# EAGLE design SBC_65C02_ISA_IRQ_v2 (EAGLE 9.6.2)
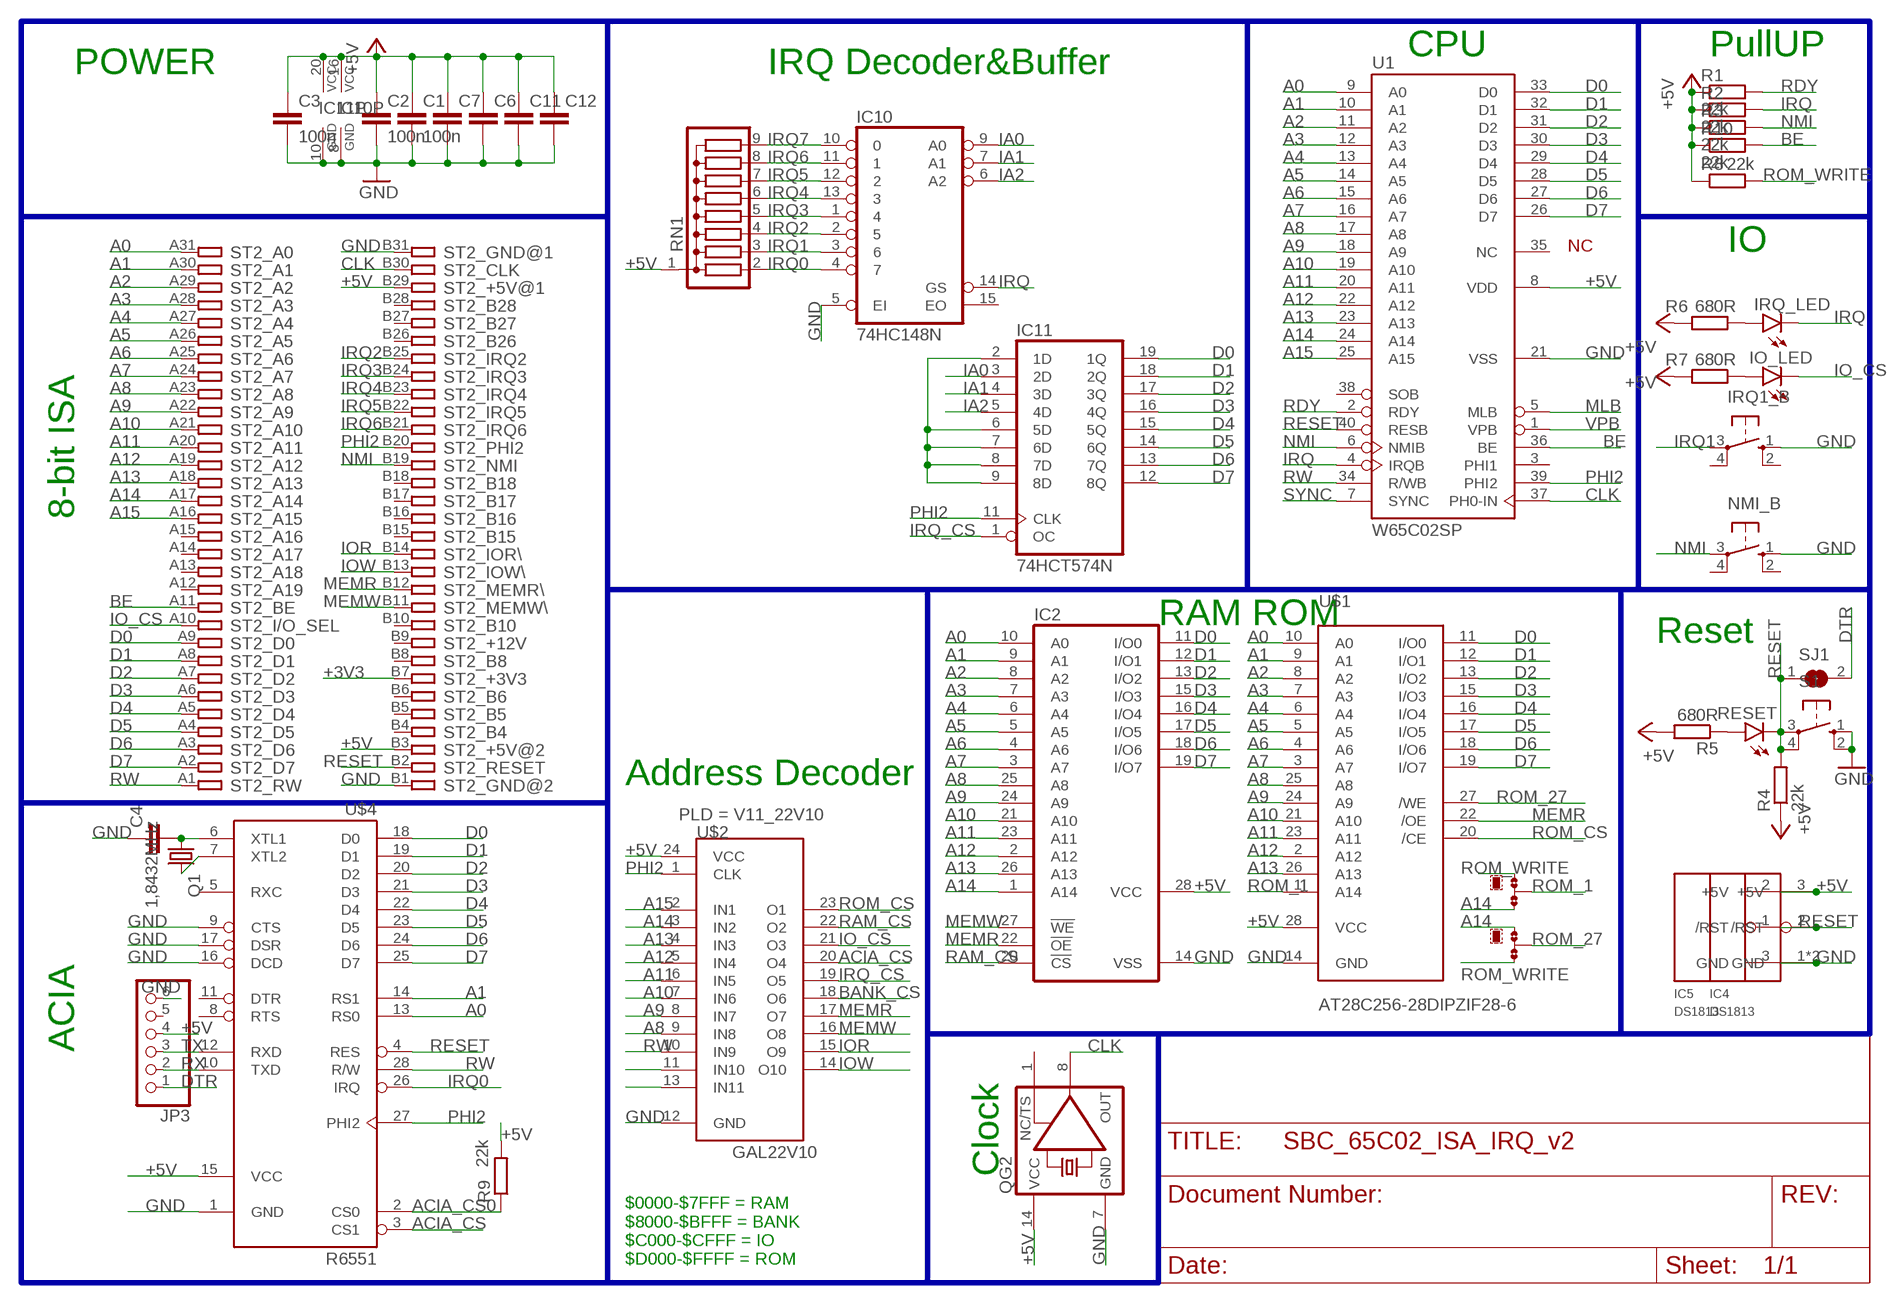
[diagram p0: schematic, sheet 1]

## Parts
C1  100n  C-EU050-025X075  [C050-025X075]
C2  100n  C-EU050-025X075  [C050-025X075]
C3  100n  C-EU050-025X075  [C050-025X075]
C4  C-EU025-030X050  [C025-030X050]
C6  C-EU050-035X075  [C050-035X075]
C7  C-EU050-035X075  [C050-035X075]
C11  C-EU050-035X075  [C050-035X075]
C12  C-EU050-035X075  [C050-035X075]
IC2  62256P  [DIL28-6]
IC4  DS1813  DS1813SOT-223  [SOT223]
IC5  DS1813  [TO-92]
IC10  74HC148N  [DIL16]
IC11  74HCT574N  [DIL20]
IO_LED  LED5MM  [LED5MM]
IRQ1_B  10-XX  [B3F-10XX]
IRQ_LED  LED5MM  [LED5MM]
JP3  PINHD-1X6/90  [1X06/90]
NMI_B  10-XX  [B3F-10XX]
Q1  1,8432MHz  CRYSTALHC49S  [HC49/S]
QG2  XO-14  [DIL14S]
R1  22k  R-EU_0207/10  [0207/10]
R2  22k  R-EU_0207/10  [0207/10]
R3  22k  R-EU_0207/10  [0207/10]
R4  22k  R-EU_0207/10  [0207/10]
R5  680R  R-EU_0207/10  [0207/10]
R6  680R  R-EU_0207/10  [0207/10]
R7  680R  R-EU_0207/10  [0207/10]
R8  22k  R-EU_0207/10  [0207/10]
R9  22k  R-EU_0207/10  [0207/10]
R10  22k  R-EU_0207/10  [0207/10]
RESET  LED5MM  [LED5MM]
RN1  G08R  [SIL9]
ROM_1  0R-JUMPA  [A0R-JMP]
ROM_27  0R-JUMPA  [A0R-JMP]
S1  10-XX  [B3F-10XX]
SJ1  SJ  [SJ]
ST2  IBM8BIT_ISA  [IBM8BIT]
U1  W65C02SP  [DIP-40]
U$1  AT28C256-28DIPZIF28-6  [228-1277-00-0602J]
U$2  GAL22V10  [DIL28_1]
U$4  R6551  [DIP-28]

## Nets
+3V3: ST2.B7
+5V [power]: C1.1 C2.1 C3.1 C6.1 C7.1 C11.1 C12.1 IC2.28(VCC) IC4.3(+5V) IC5.2(+5V) IC10.16(VCC) IC11.20(VCC) JP3.4 QG2.14(VCC) R1.1 R2.1 R3.1 R4.1 R5.2 R6.2 R7.2 R8.1 R9.2 R10.1 RN1.1 ST2.B3 ST2.B29 U1.8(VDD) U$1.28(VCC) U$2.24(VCC) U$4.15(VCC)
A0: IC2.10(A0) ST2.A31 U1.9(A0) U$1.10(A0) U$4.13(RS0)
A1: IC2.9(A1) ST2.A30 U1.10(A1) U$1.9(A1) U$4.14(RS1)
A2: IC2.8(A2) ST2.A29 U1.11(A2) U$1.8(A2)
A3: IC2.7(A3) ST2.A28 U1.12(A3) U$1.7(A3)
A4: IC2.6(A4) ST2.A27 U1.13(A4) U$1.6(A4)
A5: IC2.5(A5) ST2.A26 U1.14(A5) U$1.5(A5)
A6: IC2.4(A6) ST2.A25 U1.15(A6) U$1.4(A6)
A7: IC2.3(A7) ST2.A24 U1.16(A7) U$1.3(A7)
A8: IC2.25(A8) ST2.A23 U1.17(A8) U$1.25(A8) U$2.9(IN8)
A9: IC2.24(A9) ST2.A22 U1.18(A9) U$1.24(A9) U$2.8(IN7)
A10: IC2.21(A10) ST2.A21 U1.19(A10) U$1.21(A10) U$2.7(IN6)
A11: IC2.23(A11) ST2.A20 U1.20(A11) U$1.23(A11) U$2.6(IN5)
A12: IC2.2(A12) ST2.A19 U1.22(A12) U$1.2(A12) U$2.5(IN4)
A13: IC2.26(A13) ST2.A18 U1.23(A13) U$1.26(A13) U$2.4(IN3)
A14: IC2.1(A14) ROM_1.3 ROM_27.1 ST2.A17 U1.24(A14) U$2.3(IN2)
A15: ST2.A16 U1.25(A15) U$2.2(IN1)
ACIA_CS: U$2.20(O4) U$4.3(CS1)
ACIA_CS0: R9.1 U$4.2(CS0)
BANK_CS: U$2.18(O6)
BE: R10.2 ST2.A11 U1.36(BE)
CLK: QG2.8(OUT) ST2.B30 U1.37(PH0-IN)
D0: IC2.11(I/O0) IC11.19(1Q) ST2.A9 U1.33(D0) U$1.11(I/O0) U$4.18(D0)
D1: IC2.12(I/O1) IC11.18(2Q) ST2.A8 U1.32(D1) U$1.12(I/O1) U$4.19(D1)
D2: IC2.13(I/O2) IC11.17(3Q) ST2.A7 U1.31(D2) U$1.13(I/O2) U$4.20(D2)
D3: IC2.15(I/O3) IC11.16(4Q) ST2.A6 U1.30(D3) U$1.15(I/O3) U$4.21(D3)
D4: IC2.16(I/O4) IC11.15(5Q) ST2.A5 U1.29(D4) U$1.16(I/O4) U$4.22(D4)
D5: IC2.17(I/O5) IC11.14(6Q) ST2.A4 U1.28(D5) U$1.17(I/O5) U$4.23(D5)
D6: IC2.18(I/O6) IC11.13(7Q) ST2.A3 U1.27(D6) U$1.18(I/O6) U$4.24(D6)
D7: IC2.19(I/O7) IC11.12(8Q) ST2.A2 U1.26(D7) U$1.19(I/O7) U$4.25(D7)
DTR: JP3.1 SJ1.2
GND [power]: C1.2 C2.2 C3.2 C4.1 C6.2 C7.2 C11.2 C12.2 IC2.14(VSS) IC4.1(GND) IC4.4(GND) IC5.3(GND) IC10.5(EI) IC10.8(GND) IC11.10(GND) IRQ1_B.1(S) JP3.6 NMI_B.1(S) QG2.7(GND) S1.1(S) S1.2(S1) ST2.B1 ST2.B31 U1.21(VSS) U$1.14(GND) U$2.12(GND) U$4.1(GND) U$4.9(CTS) U$4.16(DCD) U$4.17(DSR)
IA0: IC10.9(A0) IC11.3(2D)
IA1: IC10.7(A1) IC11.4(3D)
IA2: IC10.6(A2) IC11.5(4D)
IO_CS: IO_LED.K(C) ST2.A10 U$2.21(O3)
IOR: ST2.B14 U$2.15(O9)
IOW: ST2.B13 U$2.14(O10)
IRQ: IC10.14(GS) IRQ_LED.K(C) R2.2 U1.4(IRQB)
IRQ0: IC10.4 RN1.2 U$4.26(IRQ)
IRQ1: IC10.3 IRQ1_B.3(P) RN1.3
IRQ2: IC10.2 RN1.4 ST2.B25
IRQ3: IC10.1 RN1.5 ST2.B24
IRQ4: IC10.13 RN1.6 ST2.B23
IRQ5: IC10.12 RN1.7 ST2.B22
IRQ6: IC10.11 RN1.8 ST2.B21
IRQ7: IC10.10 RN1.9
IRQ_CS: IC11.1(OC) U$2.19(O5)
MEMR: IC2.22(!OE) ST2.B12 U$1.22(/OE) U$2.17(O7)
MEMW: IC2.27(!WE) ST2.B11 U$2.16(O8)
MLB: U1.5(MLB)
N$2: IRQ_LED.A R6.1
N$6: R5.1 RESET.A
N$13: IO_LED.A R7.1
N$25: IC11.2(1D) IC11.6(5D) IC11.7(6D) IC11.8(7D) IC11.9(8D)
N$30: U$2.11(IN10)
N$31: U$2.13(IN11)
N$40: C4.2 Q1.1 U$4.6(XTL1)
N$41: Q1.2 U$4.7(XTL2)
NMI: NMI_B.3(P) R3.2 ST2.B19 U1.6(NMIB)
PHI2: IC11.11(CLK) ST2.B20 U1.39(PHI2) U$2.1(CLK) U$4.27(PHI2)
RAM_CS: IC2.20(!CS) U$2.22(O2)
RDY: R1.2 U1.2(RDY)
RESET: IC4.2(/RST) IC5.1(/RST) R4.2 RESET.K(C) S1.3(P) S1.4(P1) SJ1.1 ST2.B2 U1.40(RESB) U$4.4(RES)
ROM_1: ROM_1.2 U$1.1(A14)
ROM_27: ROM_27.2 U$1.27(/WE)
ROM_CS: U$1.20(/CE) U$2.23(O1)
ROM_WRITE: R8.2 ROM_1.1 ROM_27.3
RW: ST2.A1 U1.34(R/WB) U$2.10(IN9) U$4.28(R/W)
RX: JP3.2 U$4.10(TXD)
SYNC: U1.7(SYNC)
TX: JP3.3 U$4.12(RXD)
VPB: U1.1(VPB)
Unconnected: IC10.15(EO) IRQ1_B.2(S1) IRQ1_B.4(P1) JP3.5 NMI_B.2(S1) NMI_B.4(P1) QG2.1(TS) ST2.A12 ST2.A13 ST2.A14 ST2.A15 ST2.B4 ST2.B5 ST2.B6 ST2.B8 ST2.B9 ST2.B10 ST2.B15 ST2.B16 ST2.B17 ST2.B18 ST2.B26 ST2.B27 ST2.B28 U1.3(PHI1) U1.35(NC) U1.38(SOB) U$4.5(RXC) U$4.8(RTS) U$4.11(DTR)

## Buses
A8,A9,A10,A11,ACIA_CS,IO_CS,IO_CS_N,N$3,N$4,N$8,N$10

## Notes on the sheet
- CPU | PullUP
- POWER | IRQ Decoder&Buffer
- IO
- 8-bit ISA
- RAM ROM
- Reset
- Address Decoder
- PLD = V11_22V10
- ACIA
- Clock
- $0000-$7FFF = RAM
  $8000-$BFFF = BANK
  $C000-$CFFF = IO
  $D000-$FFFF = ROM

## Library data of the parts
C1-C3 = rcl:C-EU: CAPACITOR, European symbol
C4 C6 C7 C11 C12 = rcl:C-EU: CAPACITOR, European symbol; SPICEPREFIX: C
IC2 = memory-hitachi:62256P: MEMORY; OC_FARNELL: unknown; OC_NEWARK: unknown
IC4 IC5 = ds1813_revised:DS1813
IC10 = 74xx-eu:74*148: 10-line to 4-line and 8-line to 3-line PRIORITY ENCODER
IC11 = 74xx-eu:74*574: 8-bit D type FLIP FLOP bus driver
IO_LED IRQ_LED RESET = led:LED: LED OSRAM: - CHIPLED LG R971, LG N971, LY N971, LG Q971, LY Q971, LO R971, LY R971 LH N974, LH R974 LS Q976, LO Q976, LY Q976 LO Q996 - Hyper CHIPLED LW Q18S LB Q993, LB Q99A, LB R99A - SideLED LS A670, LO A670, LY A670, LG A670, LP A670 LB A673, LV A673, LT A673, LW A673 LH A674 LY A675 LS A676, LA A676, LO A676, LY A676, LW A676 LS A679, LY A679, LG A679 - Hyper Micro SIDELED® LS Y876, LA Y876, LO Y876, LY Y876 LT Y87S - SmartLED LW L88C, LW L88S LB L89C, LB L89S, LG L890 LS L89K, LO L89K, LY L89K LS L896, LA L896, LO L896, LY L896 - TOPLED LS T670, LO T670, LY T670, LG T670, LP T670 LSG T670, LSP T670, LSY T670, LOP T670, LYG T670 LG T671, LOG T671, LSG T671 LB T673, LV T673, LT T673, LW T673 LH T674 LS T676, LA T676, LO T676, LY T676, LB T676, LH T676, LSB T676, LW T676 LB T67C, LV T67C, LT T67C, LS T67K, LO T67K, LY T67K, LW E67C LS E67B, LA E67B, LO E67B, LY E67B, LB E67C, LV E67C, LT E67C LW T67C LS T679, LY T679, LG T679 LS T770, LO T770, LY T770, LG T770, LP T770 LB T773, LV T773, LT T773, LW T773 LH T774 LS E675, LA E675, LY E675, LS T675 LS T776, LA T776, LO T776, LY T776, LB T776 LHGB T686 LT T68C, LB T68C - Hyper Mini TOPLED® LB M676 - Mini TOPLED Santana® LG M470 LS M47K, LO M47K, LY M47K Source: http://www.osram.convergy.de LUXEON: - LUMILED® LXK2-PW12-R00, LXK2-PW12-S00, LXK2-PW14-U00, LXK2-PW14-V00 LXK2-PM12-R00, LXK2-PM12-S00, LXK2-PM14-U00 LXK2-PE12-Q00, LXK2-PE12-R00, LXK2-PE12-S00, LXK2-PE14-T00, LXK2-PE14-U00 LXK2-PB12-K00, LXK2-PB12-L00, LXK2-PB12-M00, LXK2-PB14-N00, LXK2-PB14-P00, LXK2-PB14-Q00 LXK2-PR12-L00, LXK2-PR12-M00, LXK2-PR14-Q00, LXK2-PR14-R00 LXK2-PD12-Q00, LXK2-PD12-R00, LXK2-PD12-S00 LXK2-PH12-R00, LXK2-PH12-S00 LXK2-PL12-P00, LXK2-PL12-Q00, LXK2-PL12-R00 Source: www.luxeon.com KINGBRIGHT: KA-3528ASYC Source: www.kingbright.com
IRQ1_B NMI_B S1 = switch-omron:10-XX: OMRON SWITCH; MPN: B3F-1000; OC_FARNELL: 176432; OC_NEWARK: 36M3542
JP3 = pinhead:PINHD-1X6: PIN HEADER
Q1 = crystal:CRYSTAL: CRYSTAL; OC_FARNELL: 1667008; OC_NEWARK: unknown
QG2 = crystal:XO-: CRYSTAL; OC_FARNELL: unknown; OC_NEWARK: unknown
R1-R3 R10 = rcl:R-EU_: RESISTOR, European symbol
R4-R7 = resistor:R-EU_: RESISTOR, European symbol
R8 R9 = rcl:R-EU_: RESISTOR, European symbol; SPICEPREFIX: R
RN1 = resistor-sil:G08R: SIL RESISTOR; OC_FARNELL: unknown; OC_NEWARK: unknown
ROM_1 ROM_27 = jump-0r-smd:0R-JUMP: SMD 0R 0805 Jumper
SJ1 = jumper:SJ: SMD solder JUMPER
ST2 = TiRoRiN_Libs:IBM8BIT_ISA: 8-bit CARD IBM/PC-AT
U1 = 65xxx:W65C02SP: Western Digital Version
U$1 = atmel-custom:AT28C256-28DIP: IC EEPROM 256KBIT 150NS 28DIP
U$2 = TiRoRiN_Libs:GAL22V10
U$4 = 65xxx:R6551: Rockwell R6551 ACIA Asynchronous Communiations Interface Adapter, providing UART and on-chip baud rate generator using a standard 1.8432 MHz external crystal, for speeds from 50 to 19,200 baud.

## Net classes
0 default: width 0.152 mm, drill 0.66 mm, clearance 0.254 mm
1 power: width 0.508 mm, drill 0.66 mm, clearance 0.381 mm to class 0, clearance 0.381 mm
2 data: width 0.381 mm, drill 0.66 mm, clearance 0.254 mm to class 0, clearance 0.254 mm to class 1, clearance 0.254 mm

## Board
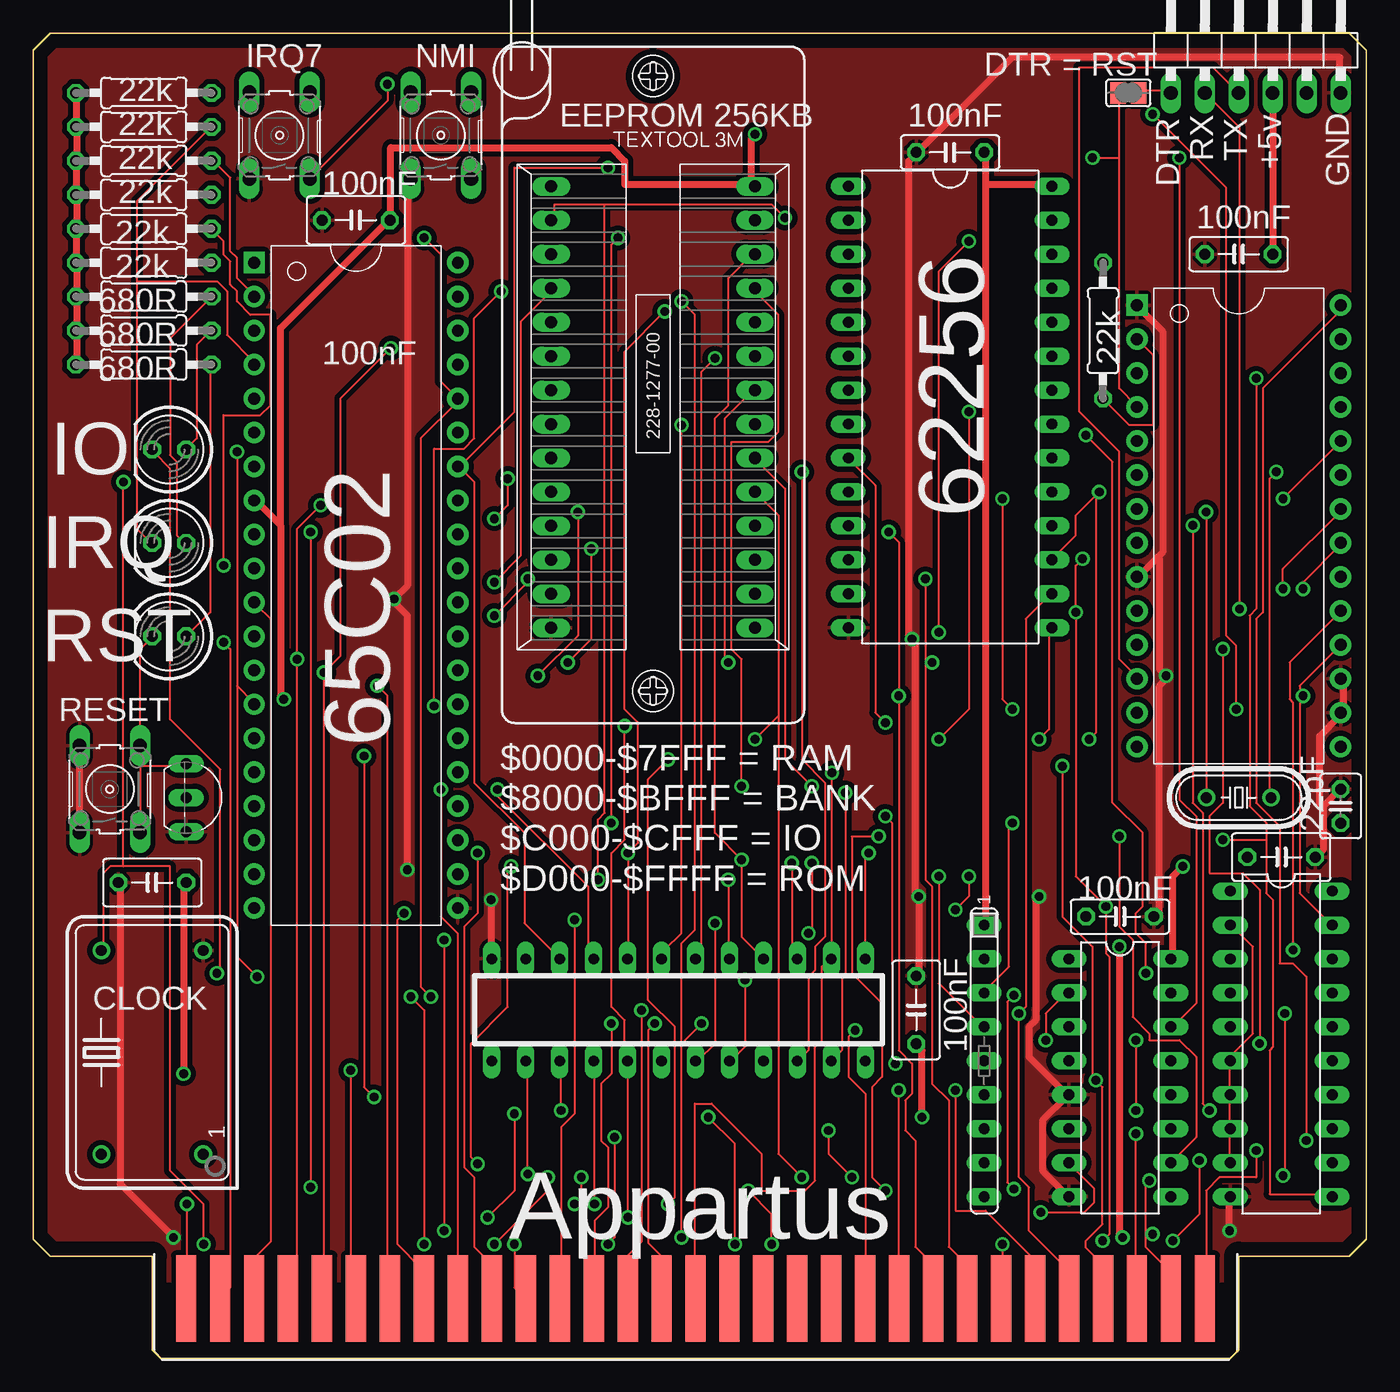
[diagram p1: board, top side]
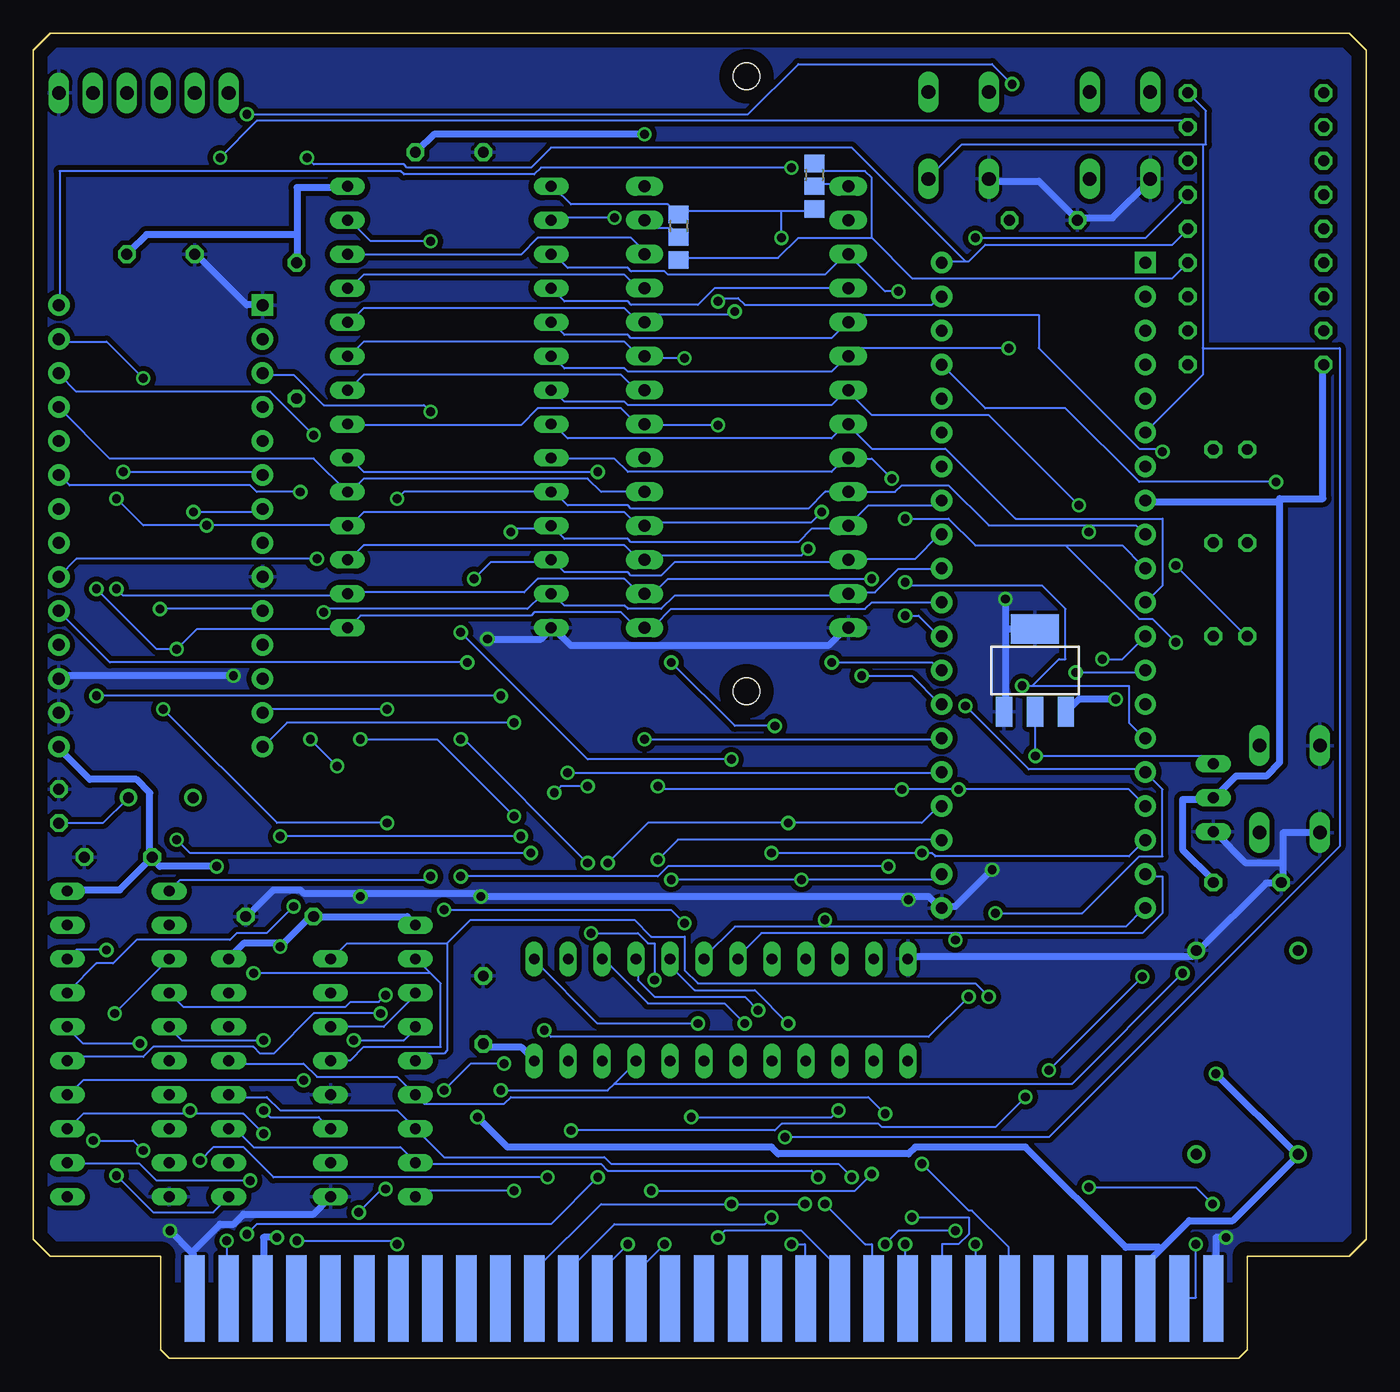
[diagram p2: board, bottom side, seen from below]

Size 99.7 x 99.06 mm. Coordinates in mm from the lower left corner, seen from the top.
Copper layers (1*16): Top 0.035mm / dielectric 1.5mm / Bottom 0.035mm
Design rules "appartus": minimum track width 6mil, minimum drill 0.35mm, track to track 6mil, track to pad 6mil, pad to pad 6mil, via to via 6mil, smd to smd 6mil, copper to edge 40mil, drill to drill 6mil, minimum pad ring 10mil, minimum via ring 8mil, stop-mask expansion 4mil, vias tented up to drill 0mil, thermal gap 10mil

### Footprints (pad centres in the part's own frame; a part is rotated, then mirrored left to right if it is on the bottom)
C050-025X075 = drill 0.813 octagon: 1 -2.54,0; 2 2.54,0
C025-030X050 = drill 0.813 octagon: 1 -1.27,0; 2 1.27,0
C050-035X075 = drill 0.813 octagon: 1 -2.54,0; 2 2.54,0
DIL28-6 = drill 0.813 long: 1 -16.51,-7.62; 2 -13.97,-7.62; 3 -11.43,-7.62; 4 -8.89,-7.62; 5 -6.35,-7.62; 6 -3.81,-7.62; 7 -1.27,-7.62; 8 1.27,-7.62; 9 3.81,-7.62; 10 6.35,-7.62; 11 8.89,-7.62; 12 11.43,-7.62; 13 13.97,-7.62; 14 16.51,-7.62; 15 16.51,7.62; 16 13.97,7.62; 17 11.43,7.62; 18 8.89,7.62; 19 6.35,7.62; 20 3.81,7.62; 21 1.27,7.62; 22 -1.27,7.62; 23 -3.81,7.62; 24 -6.35,7.62; 25 -8.89,7.62; 26 -11.43,7.62; 27 -13.97,7.62; 28 -16.51,7.62
SOT223 = smd 1.219 x 2.235: 1 -2.311,-3.099; 2 0,-3.099; 3 2.311,-3.099 | smd 3.6 x 2.2: 4 0,3.099
TO-92 = drill 0.813 long: 1 -2.54,0; 2 0,0; 3 2.54,0
DIL16 = drill 0.813 long: 1 -8.89,-3.81; 2 -6.35,-3.81; 3 -3.81,-3.81; 4 -1.27,-3.81; 5 1.27,-3.81; 6 3.81,-3.81; 7 6.35,-3.81; 8 8.89,-3.81; 9 8.89,3.81; 10 6.35,3.81; 11 3.81,3.81; 12 1.27,3.81; 13 -1.27,3.81; 14 -3.81,3.81; 15 -6.35,3.81; 16 -8.89,3.81
DIL20 = drill 0.813 long: 1 -11.43,-3.81; 2 -8.89,-3.81; 3 -6.35,-3.81; 4 -3.81,-3.81; 5 -1.27,-3.81; 6 1.27,-3.81; 7 3.81,-3.81; 8 6.35,-3.81; 9 8.89,-3.81; 10 11.43,-3.81; 11 11.43,3.81; 12 8.89,3.81; 13 6.35,3.81; 14 3.81,3.81; 15 1.27,3.81; 16 -1.27,3.81; 17 -3.81,3.81; 18 -6.35,3.81; 19 -8.89,3.81; 20 -11.43,3.81
LED5MM = drill 0.813 octagon: A -1.27,0; K 1.27,0
B3F-10XX = drill 1.016 long: 1 -3.251,2.261; 2 3.251,2.261; 3 -3.251,-2.261; 4 3.251,-2.261
1X06/90 = drill 1.016 long: 1 -6.35,-3.81; 2 -3.81,-3.81; 3 -1.27,-3.81; 4 1.27,-3.81; 5 3.81,-3.81; 6 6.35,-3.81
HC49/S = drill 0.813: 1 -2.413,0; 2 2.413,0
DIL14S = drill 0.813: 1 -7.62,-3.81; 7 7.62,-3.81; 8 7.62,3.81; 14 -7.62,3.81
0207/10 = drill 0.813 octagon: 1 -5.08,0; 2 5.08,0
SIL9 = drill 0.813 long: 1 -10.16,0; 2 -7.62,0; 3 -5.08,0; 4 -2.54,0; 5 0,0; 6 2.54,0; 7 5.08,0; 8 7.62,0; 9 10.16,0
A0R-JMP = smd 1.5 x 1.3: 1 0,1.7; 2 0,0; 3 0,-1.7
SJ = smd 1.168 x 1.6: 1 -0.762,0; 2 0.762,0
IBM8BIT = smd 1.524 x 6.477: A1 38.1,-44.45; A2 35.56,-44.45; A3 33.02,-44.45; A4 30.48,-44.45; A5 27.94,-44.45; A6 25.4,-44.45; A7 22.86,-44.45; A8 20.32,-44.45; A9 17.78,-44.45; A10 15.24,-44.45; A11 12.7,-44.45; A12 10.16,-44.45; A13 7.62,-44.45; A14 5.08,-44.45; A15 2.54,-44.45; A16 0,-44.45; A17 -2.54,-44.45; A18 -5.08,-44.45; A19 -7.62,-44.45; A20 -10.16,-44.45; A21 -12.7,-44.45; A22 -15.24,-44.45; A23 -17.78,-44.45; A24 -20.32,-44.45; A25 -22.86,-44.45; A26 -25.4,-44.45; A27 -27.94,-44.45; A28 -30.48,-44.45; A29 -33.02,-44.45; A30 -35.56,-44.45; A31 -38.1,-44.45 | smd 1.524 x 6.477 bottom: B1 38.1,-44.45; B2 35.56,-44.45; B3 33.02,-44.45; B4 30.48,-44.45; B5 27.94,-44.45; B6 25.4,-44.45; B7 22.86,-44.45; B8 20.32,-44.45; B9 17.78,-44.45; B10 15.24,-44.45; B11 12.7,-44.45; B12 10.16,-44.45; B13 7.62,-44.45; B14 5.08,-44.45; B15 2.54,-44.45; B16 0,-44.45; B17 -2.54,-44.45; B18 -5.08,-44.45; B19 -7.62,-44.45; B20 -10.16,-44.45; B21 -12.7,-44.45; B22 -15.24,-44.45; B23 -17.78,-44.45; B24 -20.32,-44.45; B25 -22.86,-44.45; B26 -25.4,-44.45; B27 -27.94,-44.45; B28 -30.48,-44.45; B29 -33.02,-44.45; B30 -35.56,-44.45; B31 -38.1,-44.45
DIP-40 = drill 0.889 pad 1.6 square: 1 -22.86,-7.62 | drill 0.889 pad 1.6: 2 -20.32,-7.62; 3 -17.78,-7.62; 4 -15.24,-7.62; 5 -12.7,-7.62; 6 -10.16,-7.62; 7 -7.62,-7.62; 8 -5.08,-7.62; 9 -2.54,-7.62; 10 0,-7.62; 11 2.54,-7.62; 12 5.08,-7.62; 13 7.62,-7.62; 14 10.16,-7.62; 15 12.7,-7.62; 16 15.24,-7.62; 17 17.78,-7.62; 18 20.32,-7.62; 19 22.86,-7.62; 20 25.4,-7.62; 21 25.4,7.62; 22 22.86,7.62; 23 20.32,7.62; 24 17.78,7.62; 25 15.24,7.62; 26 12.7,7.62; 27 10.16,7.62; 28 7.62,7.62; 29 5.08,7.62; 30 2.54,7.62; 31 0,7.62; 32 -2.54,7.62; 33 -5.08,7.62; 34 -7.62,7.62; 35 -10.16,7.62; 36 -12.7,7.62; 37 -15.24,7.62; 38 -17.78,7.62; 39 -20.32,7.62; 40 -22.86,7.62
228-1277-00-0602J = drill 0.9 long: 1 -16.51,-7.62; 2 -13.97,-7.62; 3 -11.43,-7.62; 4 -8.89,-7.62; 5 -6.35,-7.62; 6 -3.81,-7.62; 7 -1.27,-7.62; 8 1.27,-7.62; 9 3.81,-7.62; 10 6.35,-7.62; 11 8.89,-7.62; 12 11.43,-7.62; 13 13.97,-7.62; 14 16.51,-7.62; 15 16.51,7.62; 16 13.97,7.62; 17 11.43,7.62; 18 8.89,7.62; 19 6.35,7.62; 20 3.81,7.62; 21 1.27,7.62; 22 -1.27,7.62; 23 -3.81,7.62; 24 -6.35,7.62; 25 -8.89,7.62; 26 -11.43,7.62; 27 -13.97,7.62; 28 -16.51,7.62 | hole 2: 21.24,0; -24.74,0
DIL28_1 = drill 0.8 long: 1 -3.81,10.16; 2 -3.81,7.62; 3 -3.81,5.08; 4 -3.81,2.54; 5 -3.81,0; 6 -3.81,-2.54; 7 -3.81,-5.08; 8 -3.81,-7.62; 9 -3.81,-10.16; 10 -3.81,-12.7; 11 -3.81,-15.24; 12 -3.81,-17.78; 13 3.81,-17.78; 14 3.81,-15.24; 15 3.81,-12.7; 16 3.81,-10.16; 17 3.81,-7.62; 18 3.81,-5.08; 19 3.81,-2.54; 20 3.81,0; 21 3.81,2.54; 22 3.81,5.08; 23 3.81,7.62; 24 3.81,10.16
DIP-28 = drill 0.889 pad 1.6 square: 1 -15.24,-7.62 | drill 0.889 pad 1.6: 2 -12.7,-7.62; 3 -10.16,-7.62; 4 -7.62,-7.62; 5 -5.08,-7.62; 6 -2.54,-7.62; 7 0,-7.62; 8 2.54,-7.62; 9 5.08,-7.62; 10 7.62,-7.62; 11 10.16,-7.62; 12 12.7,-7.62; 13 15.24,-7.62; 14 17.78,-7.62; 15 17.78,7.62; 16 15.24,7.62; 17 12.7,7.62; 18 10.16,7.62; 19 7.62,7.62; 20 5.08,7.62; 21 2.54,7.62; 22 0,7.62; 23 -2.54,7.62; 24 -5.08,7.62; 25 -7.62,7.62; 26 -10.16,7.62; 27 -12.7,7.62; 28 -15.24,7.62

### Placement (x,y rotation side)
C1  81.28,33.02 0 top
C2  68.58,90.17 180 top
C3  90.17,82.55 180 top
C4  97.79,41.28 270 top
C6  8.89,35.56 180 top
C7  24.13,85.09 180 top
C11  93.34,37.47 0 top
C12  66.04,26.04 90 top
IC2  68.58,71.12 270 top
IC4  24.77,51.44 0 bottom
IC5  11.43,41.91 270 top
IC10  81.28,20.96 270 top
IC11  93.34,23.5 270 top
IO_LED  10.16,67.94 180 top
IRQ1_B  18.42,91.44 90 top
IRQ_LED  10.16,60.96 180 top
JP3  91.44,98.43 0 top
NMI_B  30.48,91.44 90 top
Q1  90.17,41.91 180 top
QG2  8.89,22.86 90 top
R1  8.26,89.53 0 top
R2  8.26,92.08 0 top
R3  8.26,94.62 0 top
R4  8.26,84.46 0 top
R5  8.26,74.3 180 top
R6  8.26,79.38 180 top
R7  8.26,76.84 180 top
R8  8.26,81.91 0 top
R9  80.01,76.84 90 top
R10  8.26,87 0 top
RESET  10.16,53.98 180 top
RN1  71.12,22.23 270 top
ROM_1  41.28,87.63 0 bottom
ROM_27  51.44,83.82 0 bottom
S1  5.72,42.55 90 top
SJ1  81.92,94.62 0 top
ST2  49.53,48.9 0 top
U1  24.13,59.05 270 top
U$1  46.36,71.12 270 top
U$2  52.07,26.04 270 top
U$4  90.17,63.5 270 top

### Tracks (layer width: path | path; a pad name or v marks a point on that pad's centre or on a via)
+5V  (via drill 0.66)
  Top 0.508: v66.48,18.02 66.48,23.02 66.23,23.27 C12.1 | v81.48,9.02 81.23,9.27 v81.23,30.77 | v85.98,36.77 85.23,36.02 85.23,30.02 IC10.16 | C3.1 92.73,82.77 92.73,94.52 JP3.4 | 71.23,87.77 75.98,87.77 IC2.28 | 71.23,87.77 71.23,90.02 C2.1 | R3.1 3.23,94.52 3.23,92.27 R2.1 3.23,92.02 3.23,89.77 R1.1 3.23,89.52 3.23,87.02 R10.1 3.23,86.77 3.23,84.52 R4.1 3.23,84.27 3.23,82.02 R8.1 3.23,81.77 3.23,79.52 R6.2 3.23,79.27 3.23,77.02 R7.2 3.23,76.77 3.23,74.52 R5.2 | v18.73,49.27 18.48,49.52 18.48,62.27 | 18.48,62.27 16.73,64.02 U1.8 | 18.48,62.27 18.48,77.02 26.48,85.02 C7.1 26.73,85.27 26.73,90.52 43.23,90.52 44.23,89.52 44.23,87.77 53.73,87.77 U$1.28 53.73,88.02 53.73,91.27 v53.98,91.52 | 71.23,87.77 71.23,32.52 RN1.1 | v11.23,21.27 11.23,35.52 C6.1
  Bottom 0.508: U$2.24 62.23,22.27 63.23,23.27 65.98,23.27 C12.1 | 15.36,8.15 16.48,7.02 16.48,4.52 ST2.B29 | 15.36,8.15 13.23,10.27 9.98,10.27 5.23,15.02 QG2.14 5.23,15.27 v11.23,21.27 | v66.48,18.02 64.23,15.77 44.48,15.77 43.98,15.27 34.23,15.27 33.73,15.77 25.48,15.77 17.98,8.27 15.48,8.27 15.36,8.15 | C11.1 90.98,37.27 93.23,35.02 96.98,35.02 IC11.20 | U$4.15 97.73,45.52 95.48,43.27 91.98,43.27 90.98,42.27 90.98,37.52 C11.1 | RN1.1 71.23,32.52 71.73,33.02 C1.1 78.98,33.02 80.98,31.02 81.23,31.02 | 81.23,31.02 83.98,31.02 84.98,30.02 IC10.16 | v81.48,9.02 82.48,9.02 82.48,4.52 ST2.B3 | v81.23,30.77 81.23,31.02 | v85.98,36.77 90.23,36.77 90.73,37.27 C11.1 | 79.98,84.02 79.98,87.52 76.23,87.52 IC2.28 | 79.98,84.02 79.98,82.02 R9.2 | 79.98,84.02 91.23,84.02 92.48,82.77 C3.1 | C6.1 11.48,35.77 13.73,38.02 13.73,41.77 11.48,41.77 IC5.2 11.23,42.02 9.73,43.52 7.48,43.52 6.48,44.52 6.48,64.02 | v18.73,49.27 21.48,49.27 22.23,48.52 IC4.3 | 6.48,64.02 16.48,64.02 U1.8 | R5.2 3.23,74.27 3.23,64.27 6.48,64.27 6.48,64.02 | v53.98,91.52 69.73,91.52 70.98,90.27 C2.1
A0  (via drill 0.66)
  Top 0.152: v73.23,48.52 72.48,49.27 v72.48,64.27 | v11.48,11.52 11.48,4.52 ST2.A31 | v20.73,61.77 v20.73,12.77
  Bottom 0.152: 20.73,62.27 28.23,62.27 31.23,65.27 34.73,65.27 35.23,64.77 U$1.10 40.48,64.77 41.73,63.52 54.98,63.52 55.23,63.77 59.73,63.77 60.73,64.77 IC2.10 71.98,64.77 v72.48,64.27 | 20.73,62.27 17.23,62.27 16.73,61.77 U1.9 | v73.23,48.52 82.23,48.52 82.48,48.27 U$4.13 | v11.48,11.52 12.73,12.77 v20.73,12.77 | 20.73,62.27 v20.73,61.77
A1  (via drill 0.66)
  Top 0.152: v34.48,62.77 35.48,63.77 v35.48,65.77 | v63.73,47.52 62.98,48.27 62.98,65.27 60.98,67.27 IC2.9 | v14.23,53.52 14.73,53.02 14.73,5.27 13.98,4.52 ST2.A30
  Bottom 0.152: IC2.9 60.73,67.27 56.23,67.27 55.23,66.27 39.98,66.27 38.98,67.27 U$1.9 38.73,67.27 36.98,67.27 v35.48,65.77 | 22.48,60.77 29.23,60.77 31.23,62.77 v34.48,62.77 | 22.48,60.77 18.23,60.77 16.73,59.27 U1.10 | v63.73,47.52 80.73,47.52 82.48,45.77 U$4.14 | v14.23,53.52 15.98,55.27 16.98,55.27 22.48,60.77
A2
  Top 0.152: ST2.A29 16.51,7.48 17.73,8.7 17.73,55.27 16.73,56.27 U1.11
  Bottom 0.152: IC2.8 60.73,69.77 59.73,68.77 39.98,68.77 38.98,69.77 U$1.8 38.73,69.77 36.98,68.02 31.48,68.02 26.23,62.77 15.23,62.77 15.23,57.77 16.48,56.52 U1.11
A3  (via drill 0.66)
  Top 0.152: ST2.A28 19.23,4.52 19.73,5.02 v19.73,52.27 19.73,62.02 v21.48,63.77
  Bottom 0.152: IC2.7 60.73,72.27 59.98,71.52 55.48,71.52 55.23,71.27 39.98,71.27 38.98,72.27 U$1.7 38.73,72.27 36.98,70.52 28.23,70.52 v21.48,63.77 | v19.73,52.27 18.23,52.27 16.73,53.77 U1.12
A4  (via drill 0.66)
  Top 0.152: ST2.A27 21.73,4.52 v21.73,51.27 22.98,52.52 22.98,71.77 v26.73,75.52
  Bottom 0.152: IC2.6 60.73,74.77 59.98,74.02 55.48,74.02 55.23,73.77 39.98,73.77 38.98,74.77 U$1.6 38.73,75.02 38.23,75.52 v26.73,75.52 | v21.73,51.27 16.73,51.27 U1.13
A5  (via drill 0.66)
  Top 0.152: 15.23,50.27 16.48,49.02 U1.14 | v15.23,67.77 15.23,50.27 | v23.73,21.52 23.73,4.77 23.98,4.52 ST2.A26 | v16.73,28.52 15.23,30.02 15.23,50.27
  Bottom 0.152: IC2.5 60.73,77.27 59.98,76.52 55.23,76.52 54.98,76.27 39.98,76.27 38.98,77.27 U$1.5 38.73,77.52 38.23,78.02 24.48,78.02 24.48,75.52 16.98,68.02 15.48,68.02 v15.23,67.77 | v16.73,28.52 v23.73,21.52
A6  (via drill 0.66)
  Top 0.152: v25.73,50.27 26.48,49.52 26.48,4.52 ST2.A25 | v34.48,58.02 36.48,60.02 36.48,77.52 38.73,79.77 U$1.4
  Bottom 0.152: IC2.4 60.73,79.77 59.98,79.02 55.23,79.02 54.98,78.77 49.98,78.77 48.73,80.02 38.98,80.02 U$1.4 | v25.73,50.27 24.98,50.27 | 24.98,50.27 17.73,50.27 17.73,47.52 16.73,46.52 U1.15 | v34.48,58.02 34.23,57.77 24.23,57.77 22.48,56.02 22.48,52.27 22.98,52.27 24.98,50.27
A7  (via drill 0.66)
  Top 0.152: v27.73,33.27 27.23,32.77 27.23,8.52 28.98,6.77 28.98,4.52 ST2.A24 | v34.98,79.77 32.98,77.77 32.98,68.77 32.23,68.02 29.98,68.02 v29.98,48.77
  Bottom 0.152: IC2.3 60.73,82.52 59.73,81.52 55.23,81.52 54.98,81.27 52.48,81.27 52.23,81.02 40.48,81.02 38.98,82.52 U$1.3 38.73,82.52 35.98,79.77 v34.98,79.77 | v27.73,33.27 21.23,33.27 16.98,37.52 15.23,37.52 15.23,42.52 16.48,43.77 U1.16 16.73,44.02 25.23,44.02 v29.98,48.77
A8  (via drill 0.66)
  Top 0.152: v34.73,42.52 34.73,42.02 41.48,35.27 41.48,30.27 41.73,30.02 U$2.9 | v30.48,42.52 30.48,33.02 31.73,31.77 31.73,4.52 ST2.A23 | v52.98,42.77 52.98,52.27 52.23,53.02 52.23,68.52 54.98,68.52 55.73,69.27 55.73,78.02 53.98,79.77 U$1.25
  Bottom 0.152: IC2.25 75.98,80.02 74.98,81.02 55.48,81.02 54.48,80.02 U$1.25 | U1.17 16.73,41.52 17.73,42.52 v30.48,42.52 v34.73,42.52 52.73,42.52 v52.98,42.77
A9  (via drill 0.66)
  Top 0.152: U$2.8 44.48,30.02 v44.48,37.77 45.23,38.52 45.23,47.52 44.23,48.52 44.23,75.27 v47.23,78.27 | ST2.A22 34.29,7 32.98,8.31 32.98,13.52 32.23,14.27 32.23,32.27 33.23,33.27 v33.23,37.77
  Bottom 0.152: IC2.24 75.98,77.52 74.98,78.52 55.48,78.52 54.48,77.52 53.98,77.52 U$1.24 53.73,77.52 53.23,78.02 47.48,78.02 v47.23,78.27 | v44.48,37.77 v33.23,37.77 32.48,37.77 32.23,37.52 17.73,37.52 16.73,38.52 U1.18
A10  (via drill 0.66)
  Top 0.152: v35.98,8.52 35.98,5.27 36.73,4.52 ST2.A21 | v30.73,31.27 v30.73,9.52 | v48.48,69.77 48.48,31.77 47.23,30.52 47.23,30.02 U$2.7
  Bottom 0.152: IC2.21 75.98,69.77 63.23,69.77 61.98,71.02 55.73,71.02 54.73,70.02 53.98,70.02 U$1.21 53.73,69.77 v48.48,69.77 | 30.73,31.77 16.73,31.77 15.23,33.27 15.23,36.02 16.48,36.02 U1.19 | 30.73,31.77 45.23,31.77 46.98,30.02 U$2.7 | v35.98,8.52 34.98,9.52 v30.73,9.52 | 30.73,31.77 v30.73,31.27
A11  (via drill 0.66)
  Top 0.152: v40.48,32.77 40.48,18.27 39.48,17.27 39.48,4.52 ST2.A20 | v50.98,74.77 49.98,73.77 49.98,30.27 49.73,30.02 U$2.6
  Bottom 0.152: IC2.23 75.98,75.02 74.98,76.02 55.48,76.02 54.48,75.02 53.98,75.02 U$1.23 53.73,74.77 v50.98,74.77 | 40.48,32.27 17.98,32.27 16.73,33.52 U1.20 | 40.48,32.27 47.23,32.27 49.48,30.02 U$2.6 | 40.48,32.27 v40.48,32.77
A12  (via drill 0.66)
  Top 0.152: v56.23,85.27 55.23,86.27 42.73,86.27 | 42.73,86.27 38.98,86.27 38.98,85.27 U$1.2 | v51.98,35.77 51.98,30.02 U$2.5 | v43.23,25.02 43.23,21.27 42.48,20.52 42.48,16.27 42.98,15.77 42.98,11.27 41.98,10.27 41.98,4.52 ST2.A19 | 42.73,86.27 42.73,40.77 42.23,40.27 v42.23,35.77
  Bottom 0.152: v56.23,85.27 60.73,85.27 IC2.2 | v51.98,35.77 v42.23,35.77 32.23,35.77 31.98,36.02 U1.22 | v43.23,25.02 45.73,27.52 50.23,27.52 51.98,29.27 51.98,29.77 U$2.5
A13  (via drill 0.66)
  Top 0.152: U$2.4 54.48,30.02 52.98,31.52 v52.98,37.27 50.98,39.27 50.98,70.27 51.98,71.27 51.98,80.77 53.73,82.52 U$1.26 | ST2.A18 44.45,7.67 45.48,8.7 v45.48,26.02
  Bottom 0.152: IC2.26 75.98,82.52 63.23,82.52 61.98,83.77 54.98,83.77 53.98,82.77 U$1.26 | v52.98,37.27 51.48,38.77 31.98,38.77 U1.23 | v45.48,26.02 46.48,27.02 53.23,27.02 54.48,28.27 54.48,29.77 U$2.4
A14  (via drill 0.66)
  Top 0.152: v56.73,37.02 56.73,30.27 56.98,30.02 U$2.3 | ST2.A17 46.99,7.62 45.98,8.63 45.98,24.52 v46.48,25.02 | v43.73,83.77 43.23,83.27 v43.23,40.02
  Bottom 0.152: 43.73,85.77 41.48,85.77 ROM_1.3 | 43.73,85.77 50.98,85.77 51.23,85.52 ROM_27.1 51.48,85.52 52.23,86.27 59.48,86.27 60.73,87.52 IC2.1 | v56.73,37.02 53.73,40.02 v43.23,40.02 33.23,40.02 31.98,41.27 U1.24 | v46.48,25.02 47.98,26.52 53.73,26.52 56.98,29.77 U$2.3 | v43.73,83.77 43.73,85.77
A15  (via drill 0.66)
  Top 0.152: ST2.A16 49.48,4.52 49.48,19.02 50.73,19.02 54.48,15.27 54.48,12.52 57.73,12.52 58.48,13.27 58.48,23.27 58.98,23.77 58.98,29.27 59.48,29.77 U$2.2 59.73,30.02 v59.73,43.77
  Bottom 0.152: v59.73,43.77 31.98,43.77 U1.25
ACIA_CS  (via drill 0.66)
  Top 0.152: v53.23,28.27 53.23,23.27 52.23,22.27 U$2.20 | v57.98,31.77 58.23,32.02 v58.23,37.02 | v67.73,46.27 69.98,48.52 v69.98,70.77
  Bottom 0.152: v53.23,28.27 53.23,31.02 53.73,31.02 54.48,31.77 v57.98,31.77 | v58.23,37.02 67.48,46.27 v67.73,46.27 | v69.98,70.77 70.48,71.27 77.98,71.27 80.23,73.52 82.48,73.52 U$4.3
ACIA_CS0
  Top 0.152: U$4.2 83.73,75.02 83.73,69.77 81.98,69.77 80.23,71.52 R9.1
BE  (via drill 0.66)
  Top 0.152: v29.23,83.77 30.48,82.52 30.48,73.02 31.73,71.77 U1.36 31.73,71.52 28.98,68.77 28.98,27.77 v29.73,27.02 | ST2.A11 62.23,19.77 60.98,21.02 60.98,24.02 v61.48,24.52
  Bottom 0.152: v29.23,83.77 16.48,83.77 13.48,86.77 R10.2 | v61.48,24.52 60.98,24.02 32.73,24.02 v29.73,27.02
CLK  (via drill 0.66)
  Top 0.152: 6.73,36.77 10.23,36.77 10.23,14.02 12.73,11.52 v12.73,8.52 | 6.73,36.77 5.73,36.77 5.23,36.27 5.23,30.52 QG2.8 | 6.73,36.77 v6.73,65.52
  Bottom 0.152: v12.73,8.52 12.73,4.52 13.73,4.52 ST2.B30 | v6.73,65.52 16.98,65.52 22.48,71.02 28.48,71.02 31.73,74.27 U1.37
D0  (via drill 0.66)
  Top 0.152: 94.73,49.52 94.73,50.27 97.73,53.27 U$4.18 | 94.73,49.52 94.73,34.77 96.98,32.52 IC11.19 | ST2.A9 67.31,6.98 65.98,8.31 65.98,16.27 65.23,17.02 65.23,19.27 65.73,19.77 65.73,22.02 64.73,23.02 v64.73,49.52 64.73,61.02 v63.98,61.77 | v94.98,49.52 94.73,49.52
  Bottom 0.152: U1.33 31.98,64.02 32.23,63.77 37.23,63.77 38.73,62.27 U$1.11 38.98,62.02 41.48,62.02 42.48,61.02 54.98,61.02 55.23,61.27 59.98,61.27 60.73,62.02 IC2.11 60.98,62.02 63.73,62.02 v63.98,61.77 | v64.73,49.52 v94.98,49.52
D1  (via drill 0.66)
  Top 0.152: v94.23,30.52 94.23,49.02 93.98,49.27 93.98,52.02 97.73,55.77 U$4.19 | ST2.A8 69.85,6.94 68.48,8.31 68.48,19.27 67.23,20.52 67.23,35.27 66.73,35.77 66.73,52.02 | v66.73,58.27 66.73,52.02 | 66.73,52.02 v67.23,52.02
  Bottom 0.152: IC11.18 96.48,30.52 v94.23,30.52 | U1.32 31.98,61.52 33.73,59.77 38.73,59.77 U$1.12 38.98,59.52 51.73,59.52 52.73,58.52 54.98,58.52 55.23,58.77 59.98,58.77 60.73,59.52 IC2.12 60.98,59.52 65.48,59.52 v66.73,58.27 | v67.23,52.02 93.98,52.02 97.73,55.77 U$4.19
D2  (via drill 0.66)
  Top 0.152: v78.48,59.77 77.98,59.27 v77.98,55.77 77.98,36.02 v80.23,33.77 80.23,30.27 80.48,30.02 80.48,9.27 v79.98,8.77 | v72.48,8.52 72.48,4.52 ST2.A7
  Bottom 0.152: v80.23,33.77 82.23,31.77 84.48,31.77 84.98,31.27 91.98,31.27 93.73,29.52 94.98,29.52 96.98,27.52 IC11.17 | v77.98,55.77 77.73,56.02 62.73,56.02 61.73,57.02 60.98,57.02 IC2.13 60.73,57.02 59.98,56.27 55.48,56.27 55.23,56.02 52.73,56.02 51.73,57.02 38.98,57.02 U$1.13 38.73,57.27 36.73,57.27 34.98,59.02 31.98,59.02 U1.31 | v78.48,59.77 96.48,59.77 97.73,58.52 U$4.20 | v72.48,8.52 72.73,8.77 v79.98,8.77
D3  (via drill 0.66)
  Top 0.152: v91.73,23.52 91.73,35.02 90.48,36.27 87.98,36.27 87.98,40.52 88.98,41.52 v88.98,53.02 | v94.98,57.52 94.98,58.02 97.73,60.77 U$4.21 | ST2.A6 74.93,7.32 71.23,11.02 68.98,11.02 v68.98,20.02 | v64.48,22.02 64.23,22.27 64.23,40.02 v63.73,40.52 | v75.23,46.27 75.98,47.02 75.98,54.52 IC2.15
  Bottom 0.152: v91.73,23.52 95.98,23.52 96.98,24.52 IC11.16 | U1.30 31.98,56.52 36.98,56.52 37.48,56.02 51.98,56.02 53.23,54.77 53.73,54.77 U$1.15 53.98,54.77 54.73,54.77 55.73,55.77 62.23,55.77 62.48,55.52 75.23,55.52 75.98,54.77 IC2.15 76.23,54.52 87.48,54.52 v88.98,53.02 90.48,53.02 v94.98,57.52 | v68.98,20.02 66.98,22.02 v64.48,22.02 | v63.73,40.52 69.48,46.27 v75.23,46.27
D4  (via drill 0.66)
  Top 0.152: ST2.A5 77.23,4.52 77.23,6.77 74.48,9.52 74.48,12.77 73.73,13.52 v73.73,25.77 74.23,26.27 74.23,55.27 75.98,57.02 IC2.16 | v34.48,55.52 36.98,58.02 v36.98,58.27 | v93.48,57.52 93.48,59.02 97.73,63.27 U$4.22
  Bottom 0.152: v73.73,25.77 78.73,25.77 81.73,22.77 82.73,22.77 83.23,23.27 90.73,23.27 91.48,22.52 96.73,22.52 96.98,22.27 IC11.15 | v34.48,55.52 33.48,55.52 31.98,54.02 U1.29 | v36.98,58.27 52.23,58.27 53.23,57.27 53.73,57.27 U$1.16 53.98,57.27 54.48,57.27 55.48,58.27 61.98,58.27 62.98,57.27 75.98,57.27 IC2.16 76.23,57.02 92.98,57.02 v93.48,57.52
D5  (via drill 0.66)
  Top 0.152: ST2.A4 80.01,6.99 78.73,8.27 78.73,8.77 79.98,10.02 79.98,20.27 v79.48,20.77 79.23,21.02 79.23,30.77 76.98,33.02 v76.98,44.27 | v39.98,52.02 41.73,53.77 v41.73,60.52 | 79.48,64.52 77.98,63.02 77.98,61.52 76.23,59.77 IC2.17 | v78.98,46.27 79.48,46.77 79.48,64.52 | 79.48,64.52 v79.73,64.77
  Bottom 0.152: v79.48,20.77 95.98,20.77 96.98,19.77 IC11.14 | 54.73,60.02 54.48,59.77 53.98,59.77 U$1.17 54.73,60.02 | 54.73,60.02 55.48,60.77 74.98,60.77 75.98,59.77 IC2.17 | v39.98,52.02 32.48,52.02 31.98,51.52 U1.28 | v41.73,60.52 42.23,60.02 54.73,60.02 | v79.73,64.77 82.98,64.77 83.48,65.27 96.98,65.27 97.73,66.02 U$4.23 | v78.98,46.27 v76.98,44.27
D6  (via drill 0.66)
  Top 0.152: v82.48,16.77 82.48,4.52 ST2.A3 | v37.73,51.02 40.73,54.02 v40.73,63.27 | v93.48,64.27 U$4.24 | v87.98,18.52 87.48,19.02 87.48,40.77 86.73,41.52 v86.73,62.27
  Bottom 0.152: 87.98,18.27 83.98,18.27 v82.48,16.77 | 87.98,18.27 95.98,18.27 96.98,17.27 IC11.13 | 54.73,62.52 54.48,62.27 53.98,62.27 U$1.18 54.73,62.52 | 54.73,62.52 55.48,63.27 74.98,63.27 75.98,62.27 IC2.18 76.23,62.27 v86.73,62.27 91.48,62.27 v93.48,64.27 | v37.73,51.02 33.98,51.02 31.98,49.02 U1.27 | v40.73,63.27 41.48,62.52 54.73,62.52 | v87.98,18.52 87.98,18.27
D7  (via drill 0.66)
  Top 0.152: v83.48,13.27 83.23,13.02 83.23,9.27 | 83.23,9.27 83.23,8.27 84.98,6.52 84.98,4.52 ST2.A2 | 55.73,48.02 v53.98,46.27 | 55.73,48.02 55.73,63.02 U$1.19 | v83.73,9.27 83.23,9.27 | v57.48,13.52 55.73,15.27 55.73,48.02
  Bottom 0.152: v83.48,13.27 90.48,13.27 91.73,14.52 96.98,14.52 IC11.12 | U$1.19 57.23,64.77 58.23,65.77 74.98,65.77 75.98,64.77 IC2.19 76.23,64.77 78.73,67.27 93.98,67.27 97.73,71.02 U$4.25 | v53.98,46.27 31.98,46.27 U1.26 | v83.73,9.27 82.98,10.02 60.98,10.02 v57.48,13.52
DTR
  Top 0.152: SJ1.2 82.73,94.77 84.98,94.77 JP3.1
GND  (via drill 0.66)
  Top 0.508: S1.2 3.48,45.77 3.48,39.52 S1.1 | v10.48,9.02 6.48,13.02 6.48,35.52 C6.2 | U$4.17 97.98,50.77 97.98,48.27 U$4.16 97.73,48.02 96.23,46.52 96.23,41.27 96.48,41.27 | 96.48,41.27 96.48,38.02 95.98,37.52 C11.2 | 96.48,41.27 97.73,42.52 C4.1 | 84.11,59.9 84.48,60.27 84.48,76.77 82.73,78.52 U$4.1 | 84.11,59.9 82.73,58.52 U$4.9 | 84.11,59.9 84.23,59.77 84.23,51.52 v84.73,51.02 84.73,50.77 84.23,50.27 84.23,33.27 83.98,33.02 C1.2 | NMI_B.1 27.98,88.02 27.98,57.77 v26.98,56.77 26.98,56.52 27.98,55.52 v27.98,36.52 | JP3.6 97.73,94.77 97.73,97.27 73.23,97.27 66.23,90.27 C2.2 65.98,90.02 65.48,89.52 65.48,53.77 v65.73,53.77 65.98,53.52 65.98,34.52 v66.23,34.52 66.23,28.77 C12.2 | IC10.8 77.23,12.27 75.48,14.02 75.48,17.77 77.23,19.52 IC10.5 77.23,19.77 74.48,22.52 74.48,24.77 74.98,25.27 74.98,34.27 v75.23,34.52 | v89.48,9.52 89.48,12.02 IC11.10 | v34.23,34.27 34.23,30.02 U$2.12
  Bottom 0.508: U$2.12 34.23,30.02 12.98,30.02 12.73,30.27 QG2.7 12.48,30.52 7.48,35.52 6.48,35.52 C6.2 6.23,35.77 6.23,37.02 | 6.23,37.02 6.23,39.27 3.48,39.27 S1.1 | 6.23,37.02 8.98,37.02 11.23,39.27 IC5.3 | v10.48,9.02 11.23,9.02 11.23,4.52 ST2.B31 | C3.2 87.48,82.52 83.73,78.77 82.73,78.77 U$4.1 | v84.73,51.02 97.73,51.02 U$4.17 | 26.98,54.52 26.98,48.52 IC4.1 | 26.98,54.52 24.98,54.52 IC4.4 | NMI_B.1 27.98,88.02 24.48,88.02 21.73,85.27 C7.2 21.48,85.27 18.98,85.27 16.23,88.02 IRQ1_B.1 | v26.98,56.77 26.98,54.52 | 87.86,7.9 87.73,7.77 87.73,4.52 ST2.B1 | 87.86,7.9 v89.48,9.52 | 87.86,7.9 85.73,10.02 84.73,10.02 83.98,10.77 78.73,10.77 77.48,12.02 IC10.8 | U$1.14 38.98,54.52 40.23,53.27 59.48,53.27 60.73,54.52 IC2.14 60.98,54.52 61.73,53.77 v65.73,53.77 | 75.23,34.77 79.48,34.77 79.73,35.02 81.73,35.02 83.73,33.02 C1.2 | 75.23,34.77 66.48,34.77 v66.23,34.52 34.23,34.52 | 34.23,34.52 32.73,34.52 31.98,33.77 U1.21 31.73,33.77 30.73,33.77 v27.98,36.52 | v75.23,34.52 75.23,34.77 | v34.23,34.27 34.23,34.52
  pour Top: -1.9,101.6 101.6,101.6 101.6,5.72 -1.9,5.72
  pour Bottom: 101.6,101.6 -1.9,101.6 -1.9,5.72 101.6,5.72
IA0  (via drill 0.66)
  Top 0.152: v93.48,13.65 93.61,13.77 v93.61,25.77
  Bottom 0.152: v93.48,13.65 90.73,10.9 86.23,10.9 85.11,12.02 IC10.9 | v93.61,25.77 89.61,29.77 IC11.3
IA1  (via drill 0.66)
  Top 0.152: v75.36,10.9 78.61,10.9 79.36,11.65 79.36,12.65 77.48,14.52 IC10.7 | v73.36,12.65 72.86,13.15 72.86,26.65 v73.36,27.15
  Bottom 0.152: v75.36,10.9 73.61,12.65 v73.36,12.65 | v73.36,27.15 73.86,26.65 75.98,26.65 76.36,26.27 88.48,26.27 89.48,27.27 IC11.4
IA2  (via drill 0.66)
  Top 0.152: v82.48,23.77 v82.48,18.52
  Bottom 0.152: v82.48,18.52 81.98,18.02 78.36,18.02 IC10.6 | v82.48,23.77 88.61,23.77 89.48,24.65 IC11.5
IO_CS  (via drill 0.66)
  Top 0.152: v64.73,20.02 64.73,4.52 ST2.A10 | v13.73,28.77 13.98,29.02 13.98,44.02 10.23,47.77 10.23,66.52 8.98,67.77 IO_LED.K
  Bottom 0.152: 56.23,20.52 56.73,20.02 v64.73,20.02 | 56.23,20.52 54.73,22.02 U$2.21 | v13.73,28.77 21.98,20.52 56.23,20.52
IOR  (via drill 0.66)
  Top 0.152: v39.48,18.52 39.48,22.02 U$2.15 | v50.48,18.02 52.48,16.02 v52.48,8.52
  Bottom 0.152: v39.48,18.52 39.98,18.02 v50.48,18.02 | v52.48,8.52 54.48,6.52 54.48,4.52 ST2.B14
IOW  (via drill 0.66)
  Top 0.152: v36.98,13.77 36.98,22.02 U$2.14 | v53.48,12.52 55.23,10.77 v55.23,8.52
  Bottom 0.152: v36.98,13.77 38.23,12.52 v53.48,12.52 | v55.23,8.52 56.98,6.77 56.98,4.52 ST2.B13
IRQ  (via drill 0.66)
  Top 0.152: v85.73,89.77 85.73,41.77 86.98,40.52 86.98,26.52 85.23,24.77 IC10.14 | 7.73,80.52 7.73,86.52 13.23,92.02 R2.2 | 7.73,80.52 7.73,62.02 8.73,61.02 IRQ_LED.K | 7.73,80.52 13.73,80.52 14.48,79.77 14.48,76.52 16.48,74.52 U1.4
  Bottom 0.152: v85.73,89.77 82.98,92.52 13.73,92.52 13.48,92.27 R2.2
IRQ0  (via drill 0.66)
  Top 0.152: v78.73,69.02 80.73,67.02 80.73,41.52 82.98,39.27 82.98,33.77 82.48,33.27 82.48,31.77 83.23,31.02 v83.23,28.77
  Bottom 0.152: 69.98,28.77 69.23,28.02 69.23,23.27 74.98,23.27 75.98,22.27 77.23,22.27 IC10.4 | 69.98,28.77 70.98,29.77 RN1.2 | v78.73,69.02 81.98,72.27 96.48,72.27 97.73,73.52 U$4.26 | 69.98,28.77 v83.23,28.77
IRQ1  (via drill 0.66)
  Top 0.152: v26.48,95.27 26.48,94.02 20.73,88.27 IRQ1_B.3 | v83.73,93.02 89.23,87.52 89.23,54.02 89.98,53.27 v89.98,48.52 | v73.23,40.02 72.98,39.77 72.98,29.27 71.23,27.52 RN1.3
  Bottom 0.152: IC10.3 77.23,24.77 73.48,24.77 70.98,27.27 RN1.3 | v26.48,95.27 27.98,96.77 42.48,96.77 46.23,93.02 v83.73,93.02 | v89.98,48.52 81.48,40.02 v73.23,40.02
IRQ2  (via drill 0.66)
  Top 0.152: v75.73,23.77 75.73,25.77 77.23,27.27 IC10.2 | v67.73,36.02 67.73,28.02 70.98,24.77 RN1.4 | v35.73,36.77 35.48,36.52 35.48,26.27 32.73,23.52 32.73,15.02 v33.23,14.52
  Bottom 0.152: v75.73,23.77 71.98,23.77 71.23,24.52 RN1.4 | v67.73,36.02 52.98,36.02 52.23,36.77 v35.73,36.77 | v33.23,14.52 29.73,11.02 29.48,11.02 26.73,8.27 26.73,4.52 ST2.B25
IRQ3  (via drill 0.66)
  Top 0.152: v29.23,8.52 29.23,26.02 v28.23,27.02
  Bottom 0.152: 68.73,31.02 68.73,23.02 68.98,22.77 70.48,22.77 70.98,22.27 RN1.5 | 68.73,31.02 76.23,31.02 77.23,30.02 IC10.1 | v29.23,8.52 29.23,4.52 ST2.B24 | v28.23,27.02 29.23,28.02 49.98,28.02 50.98,29.02 50.98,31.52 53.48,31.52 54.73,32.77 66.98,32.77 68.73,31.02
IRQ4  (via drill 0.66)
  Top 0.152: v33.98,10.52 35.98,12.52 v35.98,18.27
  Bottom 0.152: IC10.13 84.98,22.02 79.48,22.02 78.48,21.02 72.48,21.02 71.23,19.77 RN1.6 70.98,19.52 70.48,19.02 64.48,19.02 63.98,19.52 37.23,19.52 v35.98,18.27 | v33.98,10.52 29.73,10.52 29.73,9.27 30.48,8.52 31.73,8.52 31.73,4.52 ST2.B23
IRQ5  (via drill 0.66)
  Top 0.152: v34.48,8.52 38.48,12.52 v38.48,13.52
  Bottom 0.152: IC10.12 84.98,19.52 82.23,19.52 81.23,18.52 72.48,18.52 71.23,17.27 RN1.7 70.98,17.02 68.98,15.02 56.98,15.02 56.48,14.52 39.48,14.52 v38.48,13.52 | v34.48,8.52 34.48,4.52 ST2.B22
IRQ6  (via drill 0.66)
  Top 0.152: v40.48,11.52 40.98,12.02 v40.98,13.52
  Bottom 0.152: IC10.11 84.98,17.02 84.48,17.02 83.23,15.77 72.23,15.77 71.23,14.77 RN1.8 70.98,14.52 57.23,14.52 56.73,14.02 41.48,14.02 v40.98,13.52 | v40.48,11.52 37.48,8.52 36.98,8.52 36.98,4.52 ST2.B21
IRQ7  (via drill 0.66)
  Top 0.152: v63.73,12.52 62.73,13.52 62.73,20.27 63.48,21.02 63.48,26.52 61.23,28.77 61.23,39.02 v63.23,39.02 | v81.23,39.02 81.23,32.27 82.23,31.27 82.23,25.52 83.48,24.27 83.48,23.77 85.73,23.77 86.98,22.52 86.98,16.52 85.23,14.77 IC10.10
  Bottom 0.152: v63.73,12.52 70.73,12.52 70.98,12.27 RN1.9 | v63.23,39.02 v81.23,39.02
IRQ_CS  (via drill 0.66)
  Top 0.152: v50.98,32.52 50.98,23.52 49.73,22.27 U$2.19 | v68.98,33.52 69.98,34.52 v69.98,36.02
  Bottom 0.152: v50.98,32.52 51.98,33.52 v68.98,33.52 | v69.98,36.02 70.23,35.77 88.73,35.77 89.48,35.02 IC11.1
MEMR  (via drill 0.66)
  Top 0.152: v44.48,10.52 44.48,22.02 U$2.17 44.23,22.27 44.23,25.27 43.23,26.27 43.23,37.77 44.23,38.77 v44.23,47.27 | v51.98,52.02 51.73,52.27 51.73,70.27 53.73,72.27 U$1.22
  Bottom 0.152: IC2.22 75.98,72.52 74.98,73.52 55.73,73.52 54.73,72.52 53.98,72.52 U$1.22 | v44.48,10.52 44.98,10.02 56.23,10.02 59.48,6.77 59.48,4.52 ST2.B12 | v51.98,52.02 47.23,47.27 v44.23,47.27
MEMW  (via drill 0.66)
  Top 0.152: v41.98,11.52 41.98,22.02 U$2.16 | v69.98,83.52 67.73,81.27 v67.73,54.27 | v47.48,44.77 45.98,43.27 45.98,26.77 47.98,24.77 47.98,12.02 v47.48,11.52
  Bottom 0.152: v41.98,11.52 v47.48,11.52 57.23,11.52 62.23,6.52 ST2.B11 | v69.98,83.52 74.48,83.52 75.98,85.02 IC2.27 | v67.73,54.27 58.23,44.77 v47.48,44.77
N$2
  Top 0.152: R6.1 10.23,76.27 10.23,67.52 10.73,67.02 10.73,61.52 11.23,61.02 IRQ_LED.A
N$6
  Top 0.152: RESET.A 11.48,54.02 13.23,55.77 13.23,74.27 R5.1
N$13
  Top 0.152: IO_LED.A 11.48,68.02 12.23,68.77 12.23,75.77 13.23,76.77 R7.1
N$25
  Top 0.152: IC11.9 89.48,14.77 89.48,17.02 IC11.8 89.48,17.27 89.48,19.52 IC11.7 89.48,19.77 89.48,22.02 IC11.6 89.73,22.27 89.73,22.77 91.23,24.27 91.23,30.77 89.73,32.27 IC11.2
N$40  (via drill 0.66)
  Top 0.152: v92.98,66.27 92.48,65.77 92.48,42.02 Q1.1
  Bottom 0.152: Q1.1 92.73,41.77 94.48,40.02 97.73,40.02 C4.2 | v92.98,66.27 82.73,66.27 U$4.6
N$41  (via drill 0.66)
  Top 0.152: v87.73,63.27 87.73,42.02 Q1.2
  Bottom 0.152: v87.73,63.27 82.73,63.27 U$4.7
NMI  (via drill 0.66)
  Top 0.152: v42.98,8.52 43.48,9.02 v43.48,16.52
  Bottom 0.152: 12.23,90.77 30.23,90.77 32.73,88.27 NMI_B.3 | 12.23,90.77 11.98,90.77 11.98,93.27 13.23,94.52 R3.2 | 12.23,90.77 12.23,75.52 | 12.23,75.52 12.23,73.52 16.48,69.27 U1.6 | v42.98,8.52 41.98,8.52 41.98,4.52 ST2.B19 | v43.48,16.52 23.73,16.52 1.98,38.27 1.98,75.52 12.23,75.52
PHI2  (via drill 0.66)
  Top 0.152: 92.23,38.77 92.23,40.02 90.98,41.27 90.98,55.52 91.48,56.02 v91.48,73.27 | 92.23,38.77 92.23,34.77 92.73,34.27 92.73,23.27 92.48,23.02 92.48,12.27 96.98,12.27 IC11.11 | 48.48,23.52 v49.98,25.02 | v48.48,9.02 48.48,23.52 | v48.48,79.02 49.48,78.02 49.48,32.02 48.48,31.02 48.48,23.52 | v88.98,38.77 92.23,38.77 | v62.48,37.77 62.23,37.52 U$2.1
  Bottom 0.152: v91.48,73.27 94.23,76.02 97.73,76.02 U$4.27 | v49.98,25.02 57.48,25.02 62.23,29.77 U$2.1 | v48.48,9.02 47.98,9.52 42.23,9.52 39.48,6.77 39.48,4.52 ST2.B20 | v48.48,79.02 48.23,79.27 46.98,79.27 46.48,78.77 32.48,78.77 31.98,79.27 U1.39 | v88.98,38.77 87.98,37.77 v62.48,37.77
RAM_CS  (via drill 0.66)
  Top 0.152: v57.48,66.27 57.48,44.77 59.23,43.02 59.23,31.52 58.48,30.77 58.48,29.02 57.98,28.52 57.98,23.02 57.23,22.27 U$2.22
  Bottom 0.152: v57.48,66.27 74.98,66.27 75.98,67.27 IC2.20
RDY
  Top 0.152: R1.2 13.48,89.52 14.73,88.27 14.73,82.77 15.23,82.27 15.23,80.77 16.48,79.52 U1.2
RESET  (via drill 0.66)
  Top 0.152: 81.23,89.77 81.23,72.52 82.48,71.27 U$4.4 | 81.23,89.77 81.23,94.52 SJ1.1 | RESET.K 8.73,53.77 7.98,53.02 7.98,46.02 S1.4 7.98,45.77 7.98,44.27 | 7.98,44.27 7.98,39.52 S1.3 | v85.23,8.77 87.23,10.77 v87.23,14.77 | v61.23,13.52 59.48,15.27 v59.48,17.02 | v25.48,19.52 24.73,20.27 v24.73,45.02 | 7.98,44.27 11.23,44.27 IC5.1 | v14.23,59.27 14.23,70.52 16.98,70.52 17.73,71.27 17.73,78.02 16.23,78.02 15.23,79.02 15.23,79.77 14.73,80.27 14.73,82.02 14.23,82.52 14.23,83.52 13.48,84.27 R4.2 | v79.23,89.77 81.23,89.77
  Bottom 0.152: 29.98,82.02 31.73,82.02 U1.40 | 29.98,82.02 29.73,82.02 28.48,83.27 14.48,83.27 13.48,84.27 R4.2 | IC4.2 24.73,48.27 v24.73,45.02 11.98,45.02 11.48,44.52 IC5.1 | v85.23,8.77 85.23,4.52 ST2.B2 | v87.23,14.77 86.23,15.77 83.98,15.77 81.73,13.52 v61.23,13.52 | v59.48,17.02 44.23,17.02 43.73,17.52 36.48,17.52 36.23,17.27 27.73,17.27 v25.48,19.52 | v14.23,59.27 8.98,54.02 RESET.K | v79.23,89.77 78.73,89.27 71.98,89.27 71.73,89.02 62.48,89.02 60.98,90.52 38.48,90.52 29.98,82.02
ROM_1
  Bottom 0.152: ROM_1.2 41.23,87.77 38.98,87.77 U$1.1
ROM_27
  Bottom 0.152: ROM_27.2 51.48,84.02 51.98,84.52 53.23,84.52 53.73,85.02 U$1.27
ROM_CS  (via drill 0.66)
  Top 0.152: v60.73,42.27 60.73,28.77 60.48,28.52 60.48,23.02 59.73,22.27 U$2.23 | v58.23,42.77 56.23,44.77 56.23,65.02 53.98,67.27 U$1.20
  Bottom 0.152: v60.73,42.27 60.23,42.77 v58.23,42.77
ROM_WRITE
  Bottom 0.152: 36.98,83.77 36.98,88.27 37.48,88.77 40.73,88.77 41.23,89.27 ROM_1.1 | 36.98,83.77 42.48,83.77 43.98,82.27 51.23,82.27 ROM_27.3 | R8.2 14.48,80.77 33.98,80.77 36.98,83.77
RW  (via drill 0.66)
  Top 0.152: U$2.10 39.23,30.02 36.73,32.52 36.73,39.27 32.98,43.02 32.98,65.52 31.98,66.52 U1.34 31.98,66.77 35.98,70.77 35.98,89.02 v42.98,89.02 | v91.48,15.52 91.48,13.52 88.73,13.52 87.73,12.52 87.73,4.52 ST2.A1 | v95.23,16.27 95.23,28.52 94.23,29.52 93.23,29.52 93.23,39.77 91.48,41.52 91.48,55.27 91.98,55.77 91.98,72.52 97.73,78.27 97.73,78.52 U$4.28
  Bottom 0.152: v42.98,89.02 61.73,89.02 62.23,88.52 71.98,88.52 72.23,88.77 97.73,88.77 97.73,78.77 U$4.28 | v91.48,15.52 92.23,16.27 v95.23,16.27
RX  (via drill 0.66)
  Top 0.152: v90.23,56.02 90.23,92.02 87.73,94.52 JP3.2
  Bottom 0.152: v90.23,56.02 82.73,56.02 U$4.10
TX
  Top 0.152: JP3.3 89.98,94.77 88.23,96.52 78.23,96.52 78.23,70.77 81.23,67.77 81.23,52.27 82.48,51.02 U$4.12

### Text on the board
tNames: IRQ7 | NMI | DTR = RST | 22k | EEPROM 256KB | 100nF | 22k | 22k | RX | TX | +5v | 100nF | DTR | GND | 22k | 22k | 100nF | 22k | 680R | 680R | 680R | 100nF | 22k | IO | 62256 | IRQ | RST | RESET | 65C02 | 22pF | $0000-$7FFF = RAM / $8000-$BFFF = BANK / $C000-$CFFF = IO / $D000-$FFFF = ROM | 100nF | CLOCK | 100nF
bValues: /WE | 1 | A14 | A14 | 27 | /WE